# Altium schematic sheet HAE_Power_Protection.SchDoc
size A; SheetNumber: 2; SheetTotal: 6
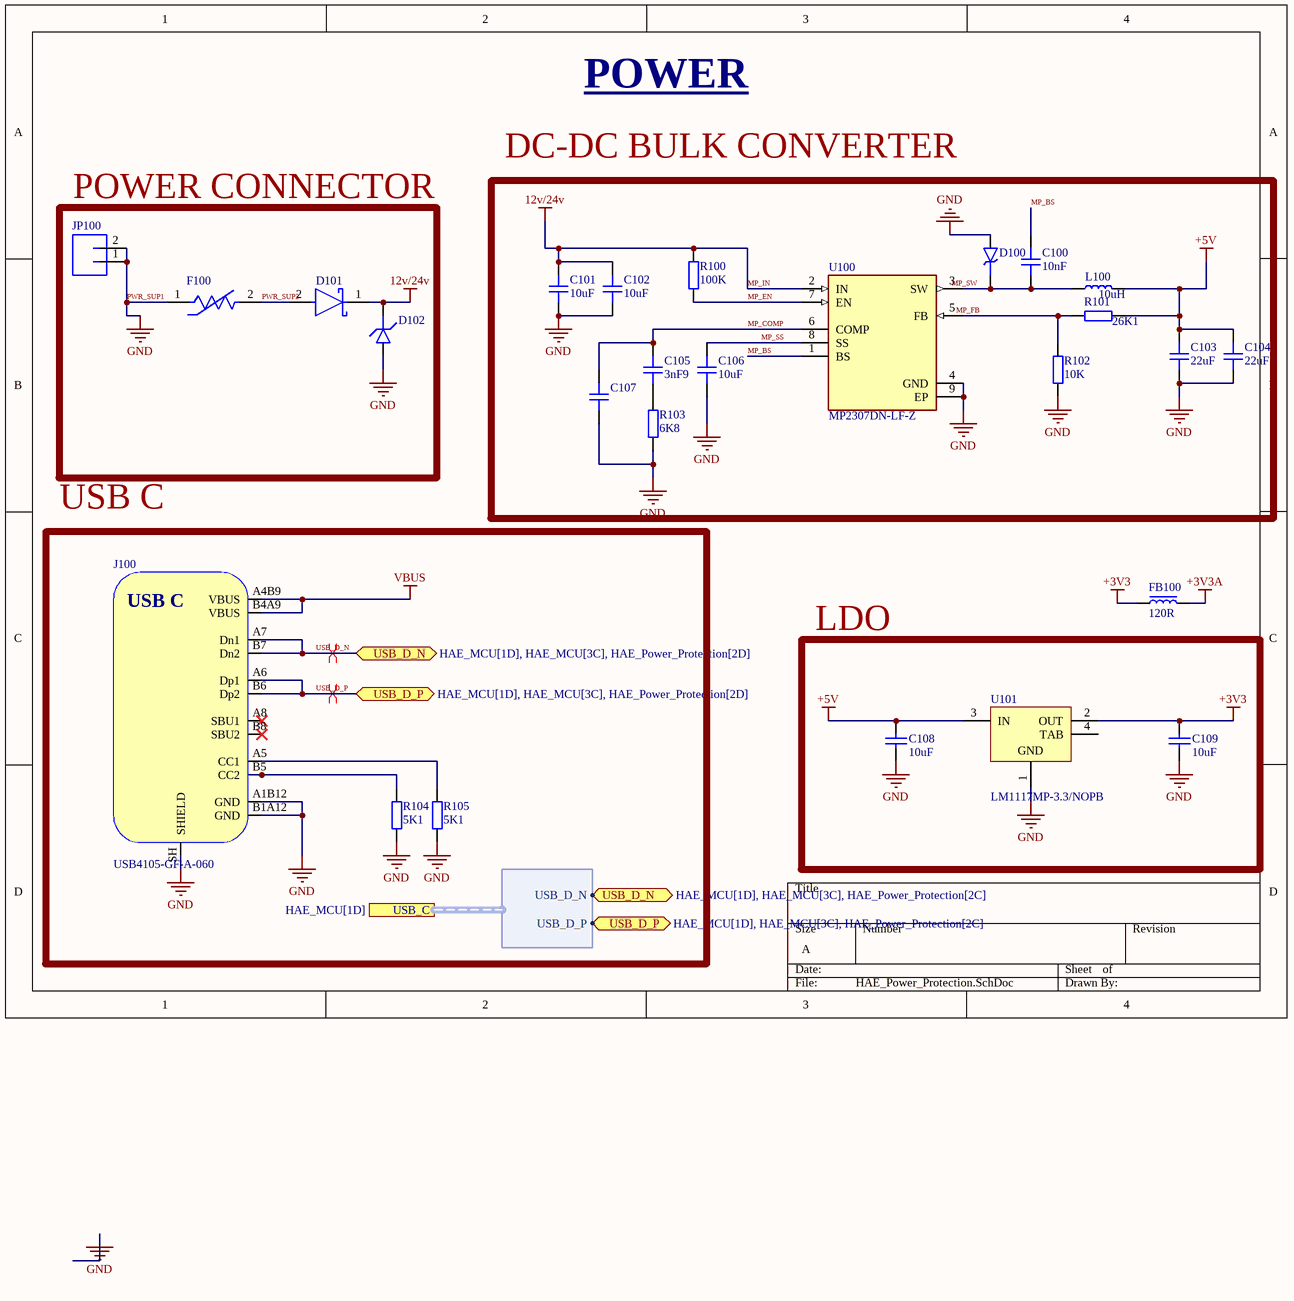
[diagram p0: HAE_Power_Protection.SchDoc]

## Parts
C100  10nF  [CAP_0603]
C101  10uF  [CAP_0603]
C102  10uF  [CAP_0603]
C103  22uF  [CAP_0603]
C104  22uF  [CAP_0603]
C105  3nF9  [CAP_0603]
C106  10uF  [CAP_0603]
C107  10uF  [CAP_0603]  (value not drawn)
C108  10uF  [CAPC2014X60X15NL20]
C109  10uF  [CAPC2014X60X15NL20]
D100  D_ZENER_SOD_323  [SOD-323]  (value not drawn)
D101  SS34-E3/9AT  [FP-SMC-MFG]  (value not drawn)
D102  D_TVS_0402  [D_0402]  (value not drawn)
F100  MF-PSMF020X-2  [FP-MF-PSMF-MFG]  (value not drawn)
FB100  120R  [FB_0603]
J100  USB4105-GF-A-060  [USB4105-GF-A-060]
JP100  MOLEX_MICROFIT_2_SMD_HORZ  [MOLEX-MICROFIT-2-SMD-HORZ]  (value not drawn)
L100  10uH  [IND_0603]
R100  100K  [RES_0603]
R101  26K1  [RES_0603]
R102  10K  [RES_0603]
R103  6K8  [RES_0603]
R104  5K1  [RES_0402]
R105  5K1  [RES_0402]
U100  MP2307DN-LF-Z  [SOIC127P600X170-9N]
U101  LM1117MP-3.3/NOPB  [DCY0004A_L]

## Blocks framed on the sheet
DC-DC BULK CONVERTER: C100-C107 D100 L100 R100-R103 U100
POWER CONNECTOR: D101 D102 F100 JP100
USB C: J100 R104 R105
LDO: C108 C109 U101

## Ports
USB_C (harness USB_C, see HAE_MCU[1D]), USB_D_N (bidir, see HAE_MCU[1D], HAE_MCU[3C], HAE_Power_Protection[2C]), USB_D_N (bidir, see HAE_MCU[1D], HAE_MCU[3C], HAE_Power_Protection[2D]), USB_D_P (bidir, see HAE_MCU[1D], HAE_MCU[3C], HAE_Power_Protection[2C]), USB_D_P (bidir, see HAE_MCU[1D], HAE_MCU[3C], HAE_Power_Protection[2D])

## Harnesses
USB_C: USB_D_N, USB_D_P

## Nets
+3V3: C109.2 FB100.1 U101.2(OUT)
+3V3A: FB100.2
+5V: C103.2 C104.2 C108.2 L100.2 R101.1 U101.3(IN)
MP_IN: C101.2 C102.2 D101.1(C) D102.K R100.2 U100.2(IN)  [also labelled 12v/24v]
PWR_SUP1: C101.1 C102.1 C103.1 C104.1 C106.1 C107.1 C108.1 C109.1 D100.A D102.A F100.1 J100.A1B12(GND) J100.B1A12(GND) J100.SH(SHIELD) JP100.1 JP100.2 R102.1 R103.1 R104.1 R105.1 U100.4(GND) U100.9(EP) U101.1(GND)  [also labelled GND]
VBUS: J100.A4B9(VBUS) J100.B4A9(VBUS)
MP_BS: C100.1 U100.1(BS)
MP_COMP: C105.2 C107.2 U100.6(COMP)
MP_EN: R100.1 U100.7(EN)
MP_FB: R101.2 R102.2 U100.5(FB)
MP_SS: C106.2 U100.8(SS)
MP_SW: C100.2 D100.K L100.1 U100.3(SW)
PWR_SUP2: D101.2(A) F100.2
USB_D_N: J100.A7(Dn1) J100.B7(Dn2) ; port USB_D_N, port USB_C.USB_D_N
USB_D_P: J100.A6(Dp1) J100.B6(Dp2) ; port USB_D_P, port USB_C.USB_D_P
NetC105_1: C105.1 R103.2
NetJ100_A5: J100.A5(CC1) R105.2
NetJ100_B5: J100.B5(CC2) R104.2

Not connected (* = marked no-connect by the designer): J100 A8(SBU1)* B8(SBU2)*; U101 4(TAB)

## Layout directives
differential pair; differential pair class USB: USB_D_N, USB_D_P

## Notes on the sheet
- POWER
- (in symbol USB4105-GF-A-060) USB C

## Library data of the parts
C100-C107 = CAP_0603: Capacitor SMD 0603; Manufacturer: *; Manufacturer Part Number: *; Distributor Link: *; LCSC: *; Rating: *; Dielectric: *
C108 C109 = CMP-2007-00011-1: TACH106M010XTA; Manufacturer: AVX Interconnect / Elco; Part Number: TACH106M010XTA
D100 = D_ZENER_SOD_323: Diode Zener SMD SOD-323
D101 = CMP-02539-000066-1: DIODE SCHOTTKY 40V 3A DO214AB; Peak Non-Repetitive Surge Current: 100A; Forward Voltage: 500mV; Element Configuration: Single; Max Reverse Current: 500uA; Case/Package: SMC; Radiation Hardening: No; Series: -; Max Surge Current: 100A; RoHS Compliant: Yes; Min Operating Temperature: -55°C; Average Rectified Current: 3A; Max Reverse Leakage Current: 500uA; Package Quantity: 3500; Max Reverse Voltage (DC): 40V; Forward Current: 3A; Packaging: Tape and Reel; Max Operating Temperature: 125°C; Max Repetitive Reverse Voltage (Vrrm): 40V; Number of Pins: 2; Mount: Surface Mount
D102 = D_TVS_0402: Diode TVS / ESD 0402
F100 = CMP-07400-000005-1: PTC RESET FUSE 9V 200MA 0805; Manufacturer: Bourns; Trip Current: 0.5A; Resistance: 0.65-3.5Ω; Current Rating: 40A; Value: 0.65-3.5Ω; Trip Time: 0.02s; Hold Current: 0.2A; ComponentLink2Description: Datasheet; Manufacturer Part Number: MF-PSMF020X-2; Height: 0.85mm; Ambient Temperature Range High: +85°C; Category: Fuse; Temperature Range Low: -40°C; ComponentLink2URL: https://www.bourns.com/docs/Product-Datasheets/mfpsmf.pdf; Temperature Range High: +85°C; RoHS: TRUE; Device Class L1: Circuit Protection; Device Class L3: unset; Package: MF-PSMF; Digikey Description: PTC RESET FUSE 9V 200MA 0805; Mouser Description: PTC Resettable Fuse 0.2A(hold) 0.5A(trip) 9V 40A 0.5W 0.02s 0.65Ohm SMD Solder Pad 0805 T/R; Voltage Rating: 9V; Automotive: No; Device Class L2: PTC Resettable Fuses; Temperature: -40°C to +85°C; Lead Free: Yes; Octopart: https://octopart.com/mf-psmf020x-2-bourns-7483437; Ambient Temperature Range Low: -40°C
FB100 = FB_0603: Ferrite Bead SMD 0603; Manufacturer: *; Manufacturer Part Number: *; Distributor Link: *; LCSC: *
J100 = USB4105-GF-A-060: USB Connector Type C SMT 12 Pin; Manufacturer: GCT; Manufacturer Part Number: USB4105-GF-A-060; Distributor Link: https://eu.mouser.com/ProductDetail/GCT/USB4105-GF-A-060?qs=QNEnbhJQKvY2mocwNJzgfA%3D%3D
JP100 = MOLEX_MICROFIT_2_SMD_HORZ: Manufacturer: Molex; PartNumber: 43650-0212; Mounting Technology: Surface Mount; PackageReference: Microfit-3.0mm
L100 = IND_0603: Inductor SMD 0603
R100-R103 = RES_0603: Resistor SMD 0603; Manufacturer: *; Manufacturer Part Number: *; Distributor Link: *; LCSC: *
R104 R105 = RES_0402: Resistor SMD 0402; Manufacturer: *; Manufacturer Part Number: *; Distributor Link: *; LCSC: *
U100 = MP2307DN-LF-Z: Buck Switching Regulator IC Positive Adjustable 0.925V 1 Output 3A 8-SOIC (0.154, 3.90mm Width) Exposed Pad; MF: Monolithic Power; Check_prices: https://www.snapeda.com/parts/MP2307DN-LF-Z/Monolithic+Power+Systems+Inc./view-part/?ref=eda; SnapEDA_Link: https://www.snapeda.com/parts/MP2307DN-LF-Z/Monolithic+Power+Systems+Inc./view-part/?ref=snap; Availability: In Stock; Value: *; Price: None; MP: MP2307DN-LF-Z; Package: SOIC-8 Monolithic Power; Purchase-URL: https://pricing.snapeda.com/search/part/MP2307DN-LF-Z/?ref=eda
U101 = CMP-0062-01638-4: 800mA Low-Dropout Linear Regulator, 4-pin SOT-223, Pb-Free; Manufacturer: Texas Instruments; CompType: LDO IC; PackageTopMarking: XYTT*N05A; High-Reliability: Y; PowerWise: N; ComponentLink1URL: http://www.ti.com/general/docs/lit/getliterature.tsp?genericPartNumber=LM1117-N&fileType=pdf; PinCount: 4; PackageDescription: Molded SOT-223, 6.50 x 3.56 x 1.6mm Body, 4 Lead, 2.3mm Pitch; Code_IPC: SOT223-4; PartNumber: LM1117MP-3.3/NOPB; Code_JEDEC: TO-261-AA; RoHS: Y; PackageReference: DCY0004A; ComponentLink1Description: Datasheet URL